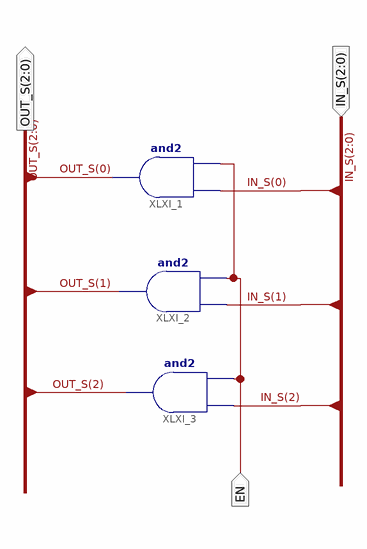
[diagram p0: schematic sheet 1]
// Xilinx ISE schematic AND_3.sch (spartan3e) as structural Verilog: 3 symbols, 3 ports
module AND_3 (
  input  [2:0] IN_S,
  input  EN,
  output [2:0] OUT_S
);

  and XLXI_1 (OUT_S[0], EN, IN_S[0]);
  and XLXI_2 (OUT_S[1], EN, IN_S[1]);
  and XLXI_3 (OUT_S[2], EN, IN_S[2]);
endmodule
